# EAGLE design ENC28J60_Ethernet (EAGLE 9.2.0)
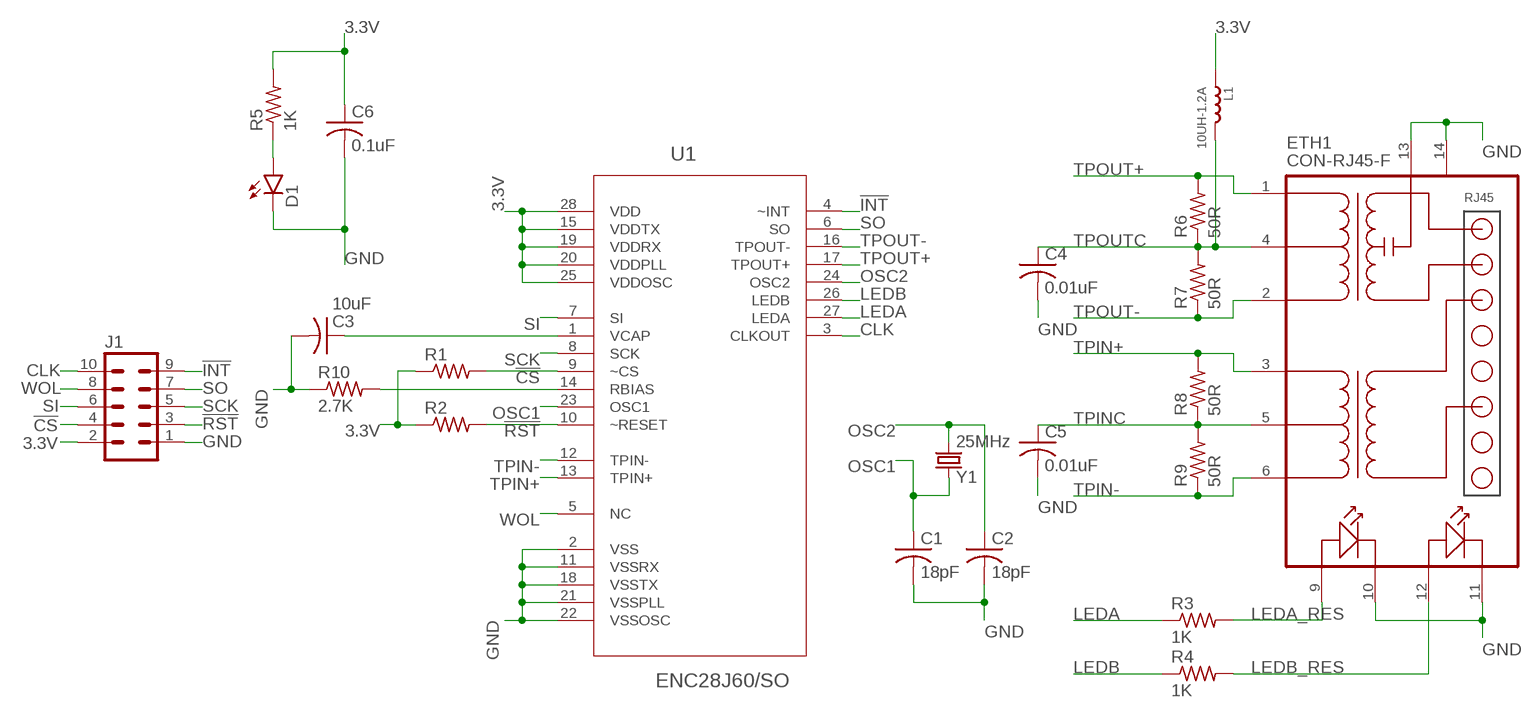
[diagram p0: schematic, sheet 1]

## Parts
C1  18pF  C-USC0805  [C0805]
C2  18pF  C-USC0805  [C0805]
C3  10uF  C-USC1210  [C1210]
C4  0.01uF  C-USC0805  [C0805]
C5  0.01uF  C-USC0805  [C0805]
C6  0.1uF  C-USC0805  [C0805]
D1  LEDCHIP-LED0805  [CHIP-LED0805]
ETH1  CON-RJ45-F  [HR911105A]
J1  MA05-2  [MA05-2]
L1  10UH-1.2A  SMD-INDUCTOR-2.2UH-20%-1.2A(0805)  [L0805]
R1  R-US_R0805  [R0805]
R2  R-US_R0805  [R0805]
R3  1K  R-US_R0805  [R0805]
R4  1K  R-US_R0805  [R0805]
R5  1K  R-US_R0805  [R0805]
R6  50R  R-US_R0805  [R0805]
R7  50R  R-US_R0805  [R0805]
R8  50R  R-US_R0805  [R0805]
R9  50R  R-US_R0805  [R0805]
R10  2.7K  R-US_R0805  [R0805]
U1  ENC28J60/SO  [SOIC127P1034X264-28N]
Y1  25MHz  CRYSTALHC49S  [HC49/S]

## Nets
3.3V: C6.1 J1.2 L1.1 R1.1 R2.1 R5.2 U1.15(VDDTX) U1.19(VDDRX) U1.20(VDDPLL) U1.25(VDDOSC) U1.28(VDD)
!CS!: J1.4 R1.2 U1.9(~CS)
!INT!: J1.9 U1.4(~INT)
!RST!: J1.3 R2.2 U1.10(~RESET)
CLK: J1.10 U1.3(CLKOUT)
GND: C1.2 C2.2 C3.2 C4.2 C5.2 C6.2 D1.C ETH1.10 ETH1.11 ETH1.13 ETH1.14 J1.1 R10.1 U1.2(VSS) U1.11(VSSRX) U1.18(VSSTX) U1.21(VSSPLL) U1.22(VSSOSC)
LEDA: R3.1 U1.27(LEDA)
LEDA_RES: ETH1.9 R3.2
LEDB: R4.1 U1.26(LEDB)
LEDB_RES: ETH1.12 R4.2
N$2: D1.A R5.1
OSC1: C1.1 U1.23(OSC1) Y1.1
OSC2: C2.1 U1.24(OSC2) Y1.2
RBIAS: R10.2 U1.14(RBIAS)
SCK: J1.5 U1.8(SCK)
SI: J1.6 U1.7(SI)
SO: J1.7 U1.6(SO)
TPIN+: ETH1.3 R8.2 U1.13(TPIN+)
TPIN-: ETH1.6 R9.1 U1.12(TPIN-)
TPINC: C5.1 ETH1.5 R8.1 R9.2
TPOUT+: ETH1.1 R6.2 U1.17(TPOUT+)
TPOUT-: ETH1.2 R7.1 U1.16(TPOUT-)
TPOUTC: C4.1 ETH1.4 L1.2 R6.1 R7.2
VCAP: C3.1 U1.1(VCAP)
WOL: J1.8 U1.5(NC)

## Library data of the parts
C1-C6 = rcl:C-US: CAPACITOR, American symbol; SPICEPREFIX: C
D1 = led:LED: LED OSRAM: - CHIPLED LG R971, LG N971, LY N971, LG Q971, LY Q971, LO R971, LY R971 LH N974, LH R974 LS Q976, LO Q976, LY Q976 LO Q996 - Hyper CHIPLED LW Q18S LB Q993, LB Q99A, LB R99A - SideLED LS A670, LO A670, LY A670, LG A670, LP A670 LB A673, LV A673, LT A673, LW A673 LH A674 LY A675 LS A676, LA A676, LO A676, LY A676, LW A676 LS A679, LY A679, LG A679 - Hyper Micro SIDELED® LS Y876, LA Y876, LO Y876, LY Y876 LT Y87S - SmartLED LW L88C, LW L88S LB L89C, LB L89S, LG L890 LS L89K, LO L89K, LY L89K LS L896, LA L896, LO L896, LY L896 - TOPLED LS T670, LO T670, LY T670, LG T670, LP T670 LSG T670, LSP T670, LSY T670, LOP T670, LYG T670 LG T671, LOG T671, LSG T671 LB T673, LV T673, LT T673, LW T673 LH T674 LS T676, LA T676, LO T676, LY T676, LB T676, LH T676, LSB T676, LW T676 LB T67C, LV T67C, LT T67C, LS T67K, LO T67K, LY T67K, LW E67C LS E67B, LA E67B, LO E67B, LY E67B, LB E67C, LV E67C, LT E67C LW T67C LS T679, LY T679, LG T679 LS T770, LO T770, LY T770, LG T770, LP T770 LB T773, LV T773, LT T773, LW T773 LH T774 LS E675, LA E675, LY E675, LS T675 LS T776, LA T776, LO T776, LY T776, LB T776 LHGB T686 LT T68C, LB T68C - Hyper Mini TOPLED® LB M676 - Mini TOPLED Santana® LG M470 LS M47K, LO M47K, LY M47K Source: http://www.osram.convergy.de LUXEON: - LUMILED® LXK2-PW12-R00, LXK2-PW12-S00, LXK2-PW14-U00, LXK2-PW14-V00 LXK2-PM12-R00, LXK2-PM12-S00, LXK2-PM14-U00 LXK2-PE12-Q00, LXK2-PE12-R00, LXK2-PE12-S00, LXK2-PE14-T00, LXK2-PE14-U00 LXK2-PB12-K00, LXK2-PB12-L00, LXK2-PB12-M00, LXK2-PB14-N00, LXK2-PB14-P00, LXK2-PB14-Q00 LXK2-PR12-L00, LXK2-PR12-M00, LXK2-PR14-Q00, LXK2-PR14-R00 LXK2-PD12-Q00, LXK2-PD12-R00, LXK2-PD12-S00 LXK2-PH12-R00, LXK2-PH12-S00 LXK2-PL12-P00, LXK2-PL12-Q00, LXK2-PL12-R00 Source: www.luxeon.com KINGBRIGHT: KA-3528ASYC Source: www.kingbright.com
ETH1 = dp_devices:CON-RJ45-F: HR911105A Female Ethernet RJ-45 with internal transformer and 2 LEDs
J1 = con-lstb:MA05-2: PIN HEADER; OC_FARNELL: unknown; OC_NEWARK: unknown
L1 = OPL_Inductor:SMD-INDUCTOR-2.2UH-20%-1.2A(0805): 303010086; MPN: LQM2MPN2R2MG0; VALUE: 2.2UH-1.2A
R1-R10 = rcl:R-US_: RESISTOR, American symbol; SPICEPREFIX: R
U1 = ENC28J60_SO:ENC28J60/SO: Stand-Alone Ethernet Controller;; AVAILABILITY: Unavailable; DESCRIPTION: Ic Ethernet Ctrlr w/Spi 28soic; MF: Microchip; MP: ENC28J60/SO; PACKAGE: SOIC-28 Microchip; PRICE: None
Y1 = crystal:CRYSTAL: CRYSTAL; OC_FARNELL: 1667008; OC_NEWARK: unknown

## Board
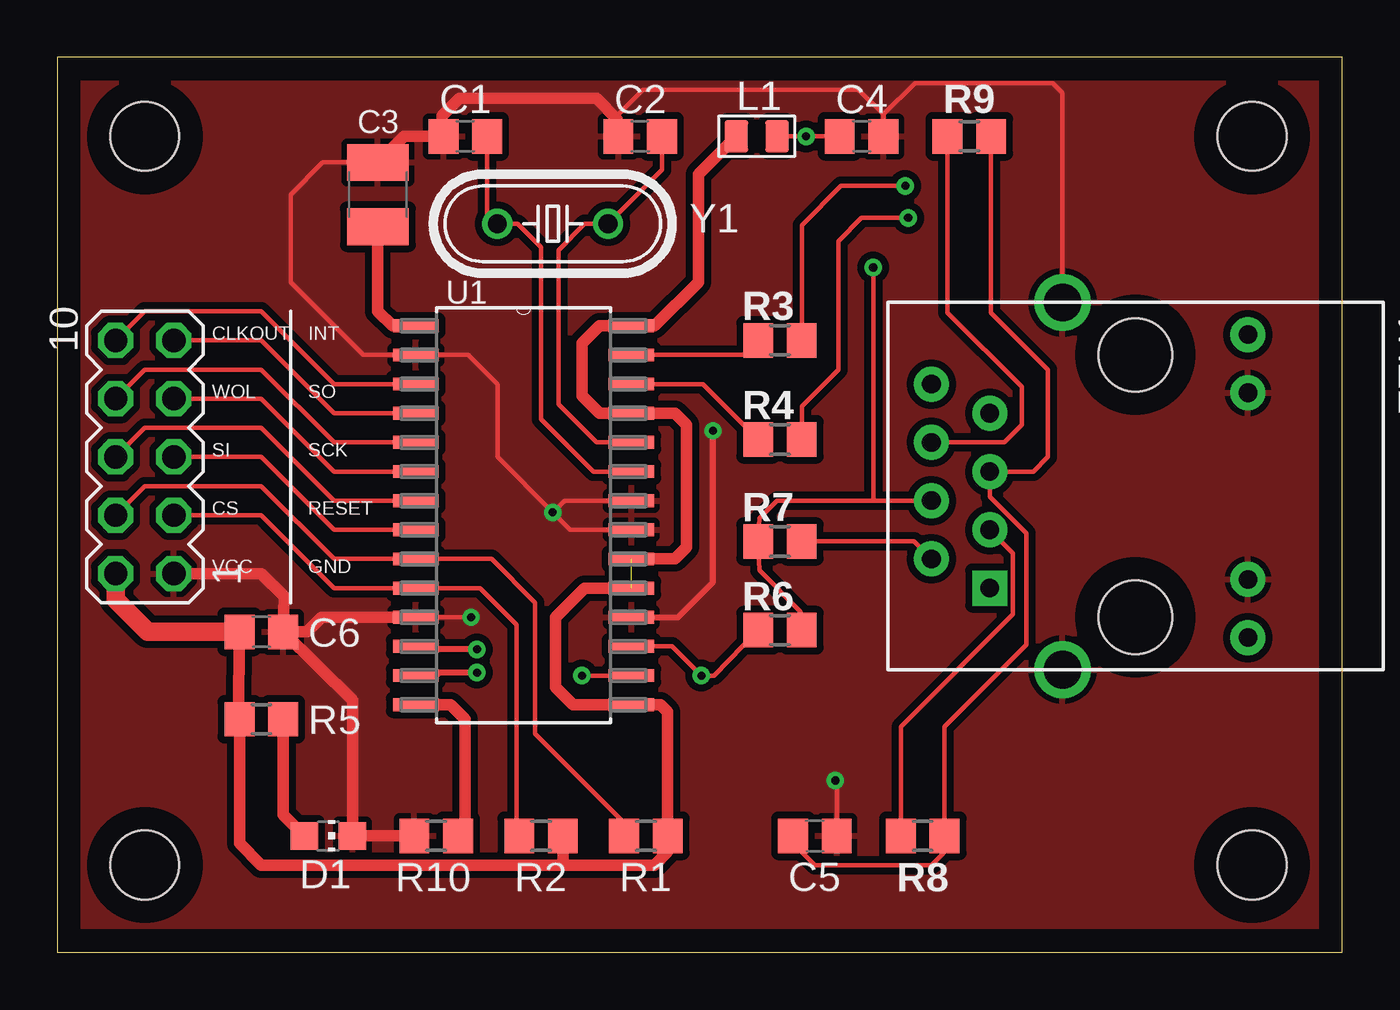
[diagram p1: board, top side]
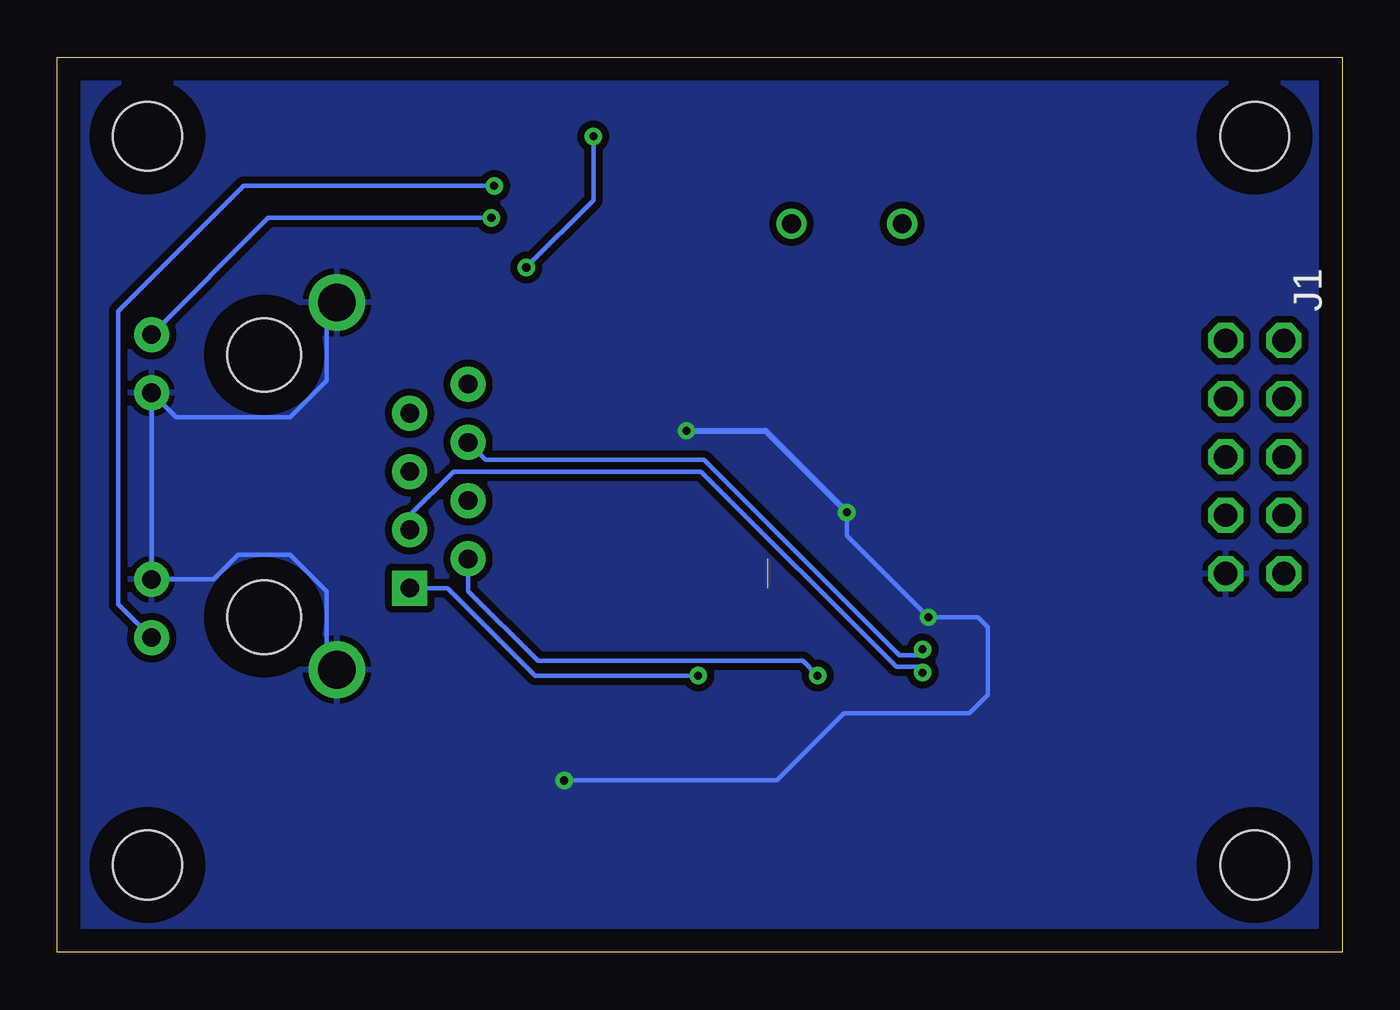
[diagram p2: board, bottom side, seen from below]

Size 56 x 39 mm. Coordinates in mm from the lower left corner, seen from the top.
Outline: 0,0 56,0 56,39 0,39 0,0
Copper layers (1*16): Top 0.035mm / dielectric 1.5mm / Bottom 0.035mm
Design rules "default": minimum track width 6mil, minimum drill 0.35mm, track to track 6mil, track to pad 6mil, pad to pad 6mil, via to via 6mil, smd to smd 6mil, copper to edge 40mil, drill to drill 6mil, minimum pad ring 10mil, minimum via ring 8mil, stop-mask expansion 4mil, vias tented up to drill 0mil, thermal gap 10mil
Holes 3 mm at 3.81,35.56 52.07,35.56 52.07,3.81 3.81,3.81

### Footprints (pad centres in the part's own frame; a part is rotated, then mirrored left to right if it is on the bottom)
C0805 = smd 1.3 x 1.5: 1 -0.95,0; 2 0.95,0
C1210 = smd 1.6 x 2.7: 1 -1.4,0; 2 1.4,0
CHIP-LED0805 = smd 1.2 x 1.2: A 0,-1.05; C 0,1.05
HR911105A = drill 0.813 pad 1.524 square: 1 4.445,-6.35 | drill 0.813 pad 1.524: 2 3.175,-8.89; 3 1.905,-6.35; 4 0.635,-8.89; 5 -0.635,-6.35; 6 -1.905,-8.89; 7 -3.175,-6.35; 8 -4.445,-8.89; 9 6.604,4.902; 10 4.064,4.902; 11 -4.064,4.902; 12 -6.604,4.902 | drill 1.651 pad 2.159: 13 8.001,-3.175; 14 -8.001,-3.175 | hole 3.2: 5.715,0; -5.715,0
MA05-2 = drill 1.016 octagon: 1 -5.08,-1.27; 2 -5.08,1.27; 3 -2.54,-1.27; 4 -2.54,1.27; 5 0,-1.27; 6 0,1.27; 7 2.54,-1.27; 8 2.54,1.27; 9 5.08,-1.27; 10 5.08,1.27
L0805 = smd 1.016 x 1.397: 1 -0.889,0; 2 0.889,0
R0805 = smd 1.3 x 1.5: 1 -0.95,0; 2 0.95,0
SOIC127P1034X264-28N = smd 1.981 x 0.559: 1 -4.699,8.255; 2 -4.699,6.985; 3 -4.699,5.715; 4 -4.699,4.445; 5 -4.699,3.175; 6 -4.699,1.905; 7 -4.699,0.635; 8 -4.699,-0.635; 9 -4.699,-1.905; 10 -4.699,-3.175; 11 -4.699,-4.445; 12 -4.699,-5.715; 13 -4.699,-6.985; 14 -4.699,-8.255; 15 4.699,-8.255; 16 4.699,-6.985; 17 4.699,-5.715; 18 4.699,-4.445; 19 4.699,-3.175; 20 4.699,-1.905; 21 4.699,-0.635; 22 4.699,0.635; 23 4.699,1.905; 24 4.699,3.175; 25 4.699,4.445; 26 4.699,5.715; 27 4.699,6.985; 28 4.699,8.255
HC49/S = drill 0.813: 1 -2.413,0; 2 2.413,0

### Placement (x,y rotation side)
C1  17.78,35.56 180 top
C2  25.4,35.56 180 top
C3  13.97,33.02 90 top
C4  35.05,35.56 0 top
C5  33.02,5.08 0 top
C6  8.89,13.97 0 top
D1  11.81,5.08 270 top
ETH1  46.99,20.32 270 top
J1  3.81,21.59 90 top
L1  30.48,35.56 0 top
R1  25.65,5.08 180 top
R2  21.08,5.08 180 top
R3  31.5,26.67 0 top
R4  31.5,22.35 0 top
R5  8.89,10.16 180 top
R6  31.5,14.05 180 top
R7  31.5,17.91 180 top
R8  37.72,5.08 180 top
R9  39.75,35.56 0 top
R10  16.51,5.08 0 top
U1  20.32,19.05 0 top
Y1  21.59,31.75 0 top

### Tracks (layer width: path | path; a pad name or v marks a point on that pad's centre or on a via)
3.3V  (1 unrouted)
  Top 0.508: C6.1 7.89,10.21 R5.2 7.94,4.76 8.89,3.81 22.1,3.81 | U1.20 26.92,17.14 27.43,17.65 27.43,22.99 26.92,23.5 U1.25 23.62,23.5 22.86,24.26 22.86,26.54 23.62,27.3 U1.28 26.04,27.3 27.94,29.21 27.94,33.91 L1.1 | 22.1,3.81 26.04,3.81 26.6,4.38 R1.1 26.6,10.48 26.29,10.79 U1.15 22.48,10.79 21.72,11.56 21.72,14.61 22.99,15.88 U1.19 | R2.1 22.03,3.88 22.1,3.81
  Top 0.813: J1.2 2.54,15.37 3.94,13.97 C6.1
!CS!
  Top 0.203: J1.4 3.81,20.32 8.89,20.32 12.06,17.14 U1.9 18.92,17.14 20.83,15.24 20.83,9.53 24.7,5.65 R1.2
!INT!
  Top 0.203: U1.4 12.06,23.5 8.89,26.67 J1.9
!RST!
  Top 0.203: J1.3 8.89,19.05 12.06,15.88 U1.10 18.41,15.88 20,14.29 20,5.21 R2.2
CLK
  Top 0.203: J1.10 3.81,27.94 8.89,27.94 12.06,24.77 U1.3
GND  (via drill 0.35)
  Top 0.203: U1.11 v18.03,14.61 | v21.59,19.18 22.1,19.68 U1.22 | U1.21 22.35,18.41 v21.59,19.18 | v21.59,19.18 19.18,21.59 19.18,24.77 17.91,26.04 U1.2 13.34,26.04 10.16,29.21 10.16,33.02 11.56,34.42 C3.2 | C2.2 24.45,36.52 25.53,37.59 34.92,37.59 36,36.52 | 36,36.52 C4.2 | ETH1.14 43.81,37.47 43.4,37.88 37.37,37.88 36,36.52 | C5.2 33.97,7.43 v33.91,7.49
  Top 0.254: U1.18 27.05,14.61 28.57,16.13 v28.57,22.73
  Top 0.508: R10.1 D1.C 12.86,11 C6.2 | 6.35,16.51 J1.1 8.89,16.51 9.89,15.51 C6.2 | U1.11 11.53,14.61 10.89,13.97 C6.2 | C3.2 15.11,35.56 C1.2 16.76,35.58 16.76,36.45 17.53,37.21 23.5,37.21 24.4,36.31 C2.2
  Bottom 0.203: v21.59,19.18 21.59,18.16 v18.03,14.61 15.88,14.61 15.43,14.16 15.43,11.24 16.26,10.41 21.72,10.41 24.64,7.49 v33.91,7.49 | ETH1.14 44.27,27.86 44.27,24.91 45.86,23.32 50.83,23.32 ETH1.11 ETH1.10 49.18,16.26 48.12,17.32 45.86,17.32 44.27,15.73 44.27,12.78 ETH1.13
  Bottom 0.254: v28.57,22.73 25.15,22.73 v21.59,19.18
  pour Bottom (isolate 0.305): -1.27,40.64 58.42,40.64 58.42,-1.27 -1.27,-1.27
  pour Top (isolate 0.305): -2.54,41.91 59.69,41.91 59.69,-2.54 -2.54,-2.54
LEDA
  Top 0.203: U1.27 29.91,26.04 R3.1
LEDA_RES  (via drill 0.35)
  Top 0.203: R3.2 32.45,31.68 34.16,33.4 v36.96,33.4
  Bottom 0.203: v36.96,33.4 47.88,33.4 53.34,27.94 53.34,15.16 ETH1.9
LEDB
  Top 0.203: U1.26 28.13,24.77 R4.1
LEDB_RES  (via drill 0.35)
  Top 0.203: R4.2 32.45,23.81 34.04,25.4 34.04,30.99 35.05,32 v37.08,32
  Bottom 0.203: v37.08,32 46.81,32 ETH1.12
N$2
  Top 0.508: R5.1 9.84,6 D1.A
OSC1
  Top 0.203: U1.23 23.37,20.95 21.08,23.24 21.08,30.73 20.07,31.75 Y1.1 18.73,32.2 C1.1
OSC2
  Top 0.203: U1.24 23.5,22.23 21.84,23.88 21.84,30.61 22.99,31.75 Y1.2 26.35,34.1 C2.1
RBIAS
  Top 0.508: U1.14 17.14,10.79 17.78,10.16 17.78,5.08 R10.2
SCK
  Top 0.203: J1.5 8.89,21.59 12.06,18.41 U1.8
SI
  Top 0.203: U1.7 12.06,19.68 8.89,22.86 3.81,22.86 J1.6
SO
  Top 0.203: U1.6 12.06,20.95 8.89,24.13 J1.7
TPIN+  (via drill 0.35)
  Top 0.203: R8.2 36.77,9.85 41.66,14.73 41.66,17.4 ETH1.3 | 16.51,12.06 U1.13
  Top 0.254: v18.29,12.19 16.64,12.19 16.51,12.06
  Bottom 0.203: 18.41,12.32 v18.29,12.19 18.54,12.45 19.43,12.45 27.94,20.95 38.73,20.95 40.64,19.05 ETH1.3
TPIN-  (via drill 0.35)
  Top 0.203: ETH1.6 41.27,22.23 42.04,22.99 42.04,24.64 38.8,27.87 R9.1 | 16.51,13.21 15.75,13.21 U1.12
  Top 0.254: v18.29,13.21 16.51,13.21
  Bottom 0.203: ETH1.6 37.34,21.46 27.81,21.46 19.3,12.95 18.54,12.95 v18.29,13.21
TPINC
  Top 0.203: C5.1 32.02,4.81 33.02,3.81 38.1,3.81 38.62,4.33 R8.1 38.67,9.84 42.23,13.4 42.23,18.26 40.64,19.85 ETH1.5 42.55,20.95 43.18,21.59 43.18,25.4 40.7,27.88 R9.2
TPOUT+  (via drill 0.35)
  Top 0.203: U1.17 26.8,13.34 v28.07,12.06 28.61,12.06 R6.2
  Bottom 0.203: v28.07,12.06 35.18,12.06 38.99,15.88 ETH1.1
TPOUT-  (via drill 0.35)
  Top 0.203: U1.16 v22.86,12.06 | R7.1 37.34,17.91 ETH1.2
  Bottom 0.203: v22.86,12.06 23.5,12.7 35.05,12.7 38.1,15.75 ETH1.2
TPOUTC  (via drill 0.35)
  Top 0.203: R6.1 32.4,14.85 30.6,16.65 R7.2 30.6,18.91 31.37,19.68 35.56,19.68 | ETH1.4 35.56,19.68 | v35.56,29.84 35.56,19.68 | C4.1 v32.64,35.56 L1.2
  Bottom 0.203: v35.56,29.84 32.64,32.77 v32.64,35.56
VCAP
  Top 0.508: U1.1 14.61,27.3 13.97,27.94 C3.1
WOL
  Top 0.203: J1.8 3.81,25.4 8.89,25.4 12.06,22.23 U1.5

### Text on the board
tNames: CLKOUT | INT | WOL | SO | SI | SCK | CS | RESET | VCC | GND